# EAGLE design u10-normal (EAGLE 6.5.0)
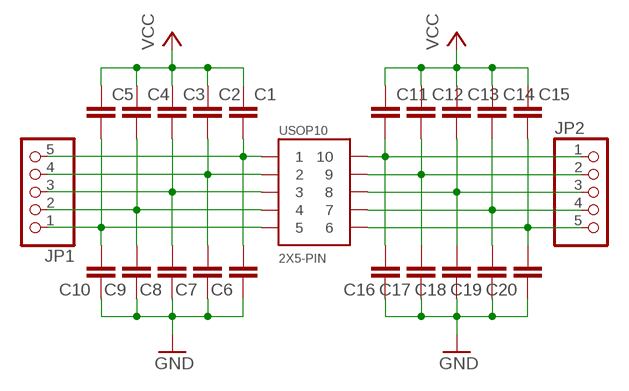
[diagram p0: schematic, sheet 1]

## Parts
C1  C-EUC0603  [C0603]
C2  C-EUC0603  [C0603]
C3  C-EUC0603  [C0603]
C4  C-EUC0603  [C0603]
C5  C-EUC0603  [C0603]
C6  C-EUC0805  [C0805]
C7  C-EUC0805  [C0805]
C8  C-EUC0805  [C0805]
C9  C-EUC0805  [C0805]
C10  C-EUC0805  [C0805]
C11  C-EUC0603  [C0603]
C12  C-EUC0603  [C0603]
C13  C-EUC0603  [C0603]
C14  C-EUC0603  [C0603]
C15  C-EUC0603  [C0603]
C16  C-EUC0805  [C0805]
C17  C-EUC0805  [C0805]
C18  C-EUC0805  [C0805]
C19  C-EUC0805  [C0805]
C20  C-EUC0805  [C0805]
JP1  PINHD-1X5  [1X05]
JP2  PINHD-1X5  [1X05]
USOP10  2X5-PIN  [USOP10]

## Nets
1: C1.2 C6.2 JP1.5 USOP10.P$1
2: C2.2 C7.2 JP1.4 USOP10.P$2
3: C3.2 C8.2 JP1.3 USOP10.P$3
4: C4.2 C9.2 JP1.2 USOP10.P$4
5: C5.2 C10.2 JP1.1 USOP10.P$5
GND: C6.1 C7.1 C8.1 C9.1 C10.1 C16.1 C17.1 C18.1 C19.1 C20.1
N$6: C15.2 C20.2 JP2.5 USOP10.P$6
N$7: C14.2 C19.2 JP2.4 USOP10.P$7
N$8: C13.2 C18.2 JP2.3 USOP10.P$8
N$9: C12.2 C17.2 JP2.2 USOP10.P$9
N$10: C11.2 C16.2 JP2.1 USOP10.P$10
VCC: C1.1 C2.1 C3.1 C4.1 C5.1 C11.1 C12.1 C13.1 C14.1 C15.1

## Library data of the parts
C1-C20 = p.peter-rcl:C-EU: CAPACITOR, European symbol
JP1 JP2 = pinhead:PINHD-1X5: PIN HEADER
USOP10 = p.peter-pacakages:2X5-PIN

## Board
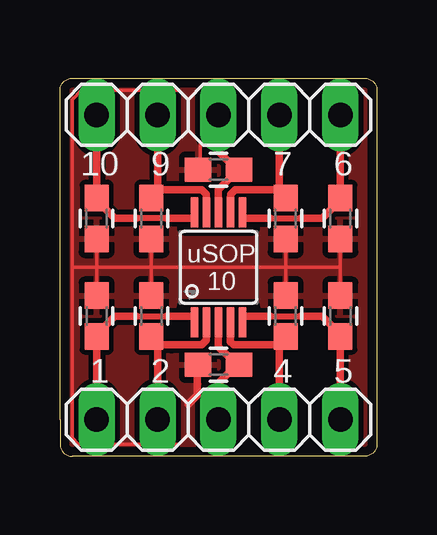
[diagram p1: board, top side]
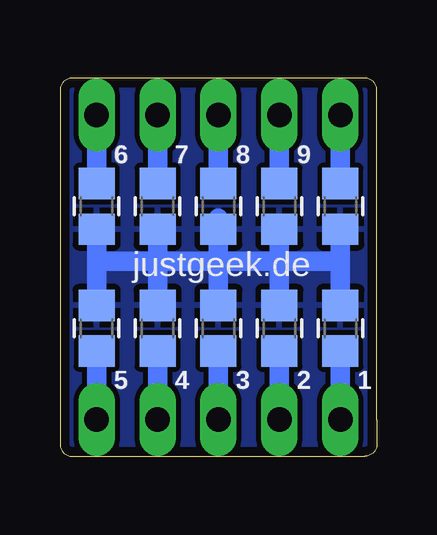
[diagram p2: board, bottom side, seen from below]

Size 13.21 x 15.75 mm. Coordinates in mm from the lower left corner, seen from the top.
Outline: 0,1.52 0,15.24 arc-90 0.51,15.75 11.68,15.75 12.7,15.75 arc-90 13.21,15.24 13.21,1.52 13.21,0.51 arc-90 12.7,0 0.51,0 arc-90 0,0.51 0,1.52
Copper layers (1*16): Top 0.0356mm / dielectric 1.5011mm / Bottom 0.0356mm
Design rules "oshpark": minimum track width 6mil, minimum drill 13mil, track to track 6mil, track to pad 6mil, pad to pad 6mil, via to via 6mil, smd to smd 6mil, copper to edge 15mil, drill to drill 6mil, minimum pad ring 7mil, minimum via ring 7mil, stop-mask expansion 4mil, vias tented up to drill 4.1mm, thermal gap 10mil
tRestrict: 6 lines

### Footprints (pad centres in the part's own frame; a part is rotated, then mirrored left to right if it is on the bottom)
C0603 = smd 1.1 x 1: 1 -0.85,0; 2 0.85,0
C0805 = smd 1.3 x 1.5: 1 -0.95,0; 2 0.95,0
1X05 = drill 1.016 long: 1 -5.08,0; 2 -2.54,0; 3 0,0; 4 2.54,0; 5 5.08,0
USOP10 = smd 0.3 x 1.25: P$1 -1,-2.3; P$2 -0.5,-2.3; P$3 0,-2.3; P$4 0.5,-2.3; P$5 1,-2.3; P$6 1,2.3; P$7 0.5,2.3; P$8 0,2.3; P$9 -0.5,2.3; P$10 -1,2.3

### Placement (x,y rotation side)
C1  1.52,5.84 270 top
C2  3.81,5.84 270 top
C3  6.6,3.81 0 top
C4  9.4,5.84 270 top
C5  11.68,5.84 270 top
C6  1.52,5.33 270 bottom
C7  4.06,5.33 270 bottom
C8  6.6,5.33 270 bottom
C9  9.14,5.33 270 bottom
C10  11.68,5.33 270 bottom
C11  1.52,9.91 90 top
C12  3.81,9.91 90 top
C13  6.6,11.94 0 top
C14  9.4,9.91 90 top
C15  11.68,9.91 90 top
C16  1.52,10.41 90 bottom
C17  4.06,10.41 90 bottom
C18  6.6,10.41 90 bottom
C19  9.14,10.41 90 bottom
C20  11.68,10.41 90 bottom
JP1  6.6,1.52 180 top
JP2  6.6,14.22 0 top
USOP10  6.6,7.87 0 top

### Tracks (layer width: path | path; a pad name or v marks a point on that pad's centre or on a via)
1
  Top 0.254: 3.18,5.84 4.45,5.84
  Top 0.305: C1.2 1.52,5.08 | 2.16,5.72 2.29,5.84 | 2.29,5.84 3.18,5.84 | 4.45,5.84 5.33,5.84 5.59,5.84 5.59,5.59 USOP10.P$1 | C1.2 JP1.5 | 2.16,5.72 2.29,5.84 | 2.29,5.84 2.16,5.72 | 2.16,5.72 1.91,5.46 1.65,5.21 1.65,5.12 C1.2 | 1.5,5.02 C1.2
  Bottom 0.813: C6.2 JP1.5
2
  Top 0.305: C2.2 3.81,4.83 | 3.81,4.83 3.81,5.08 | C2.2 3.81,4.83 | JP1.4 4.06,4.57 | USOP10.P$2 6.1,4.83 5.91,4.64 4.64,4.64 4.13,4.64 4.06,4.57 | C2.2 3.81,4.83 | 3.81,4.83 4.06,4.57
  Bottom 0.813: C7.2 JP1.4
3
  Top 0.305: USOP10.P$3 6.6,4.57 7.11,4.06 7.2,4.06 C3.2 7.37,3.81 6.6,3.05 JP1.3
  Bottom 0.813: C8.2 JP1.3
4
  Top 0.305: USOP10.P$4 7.1,5.15 7.1,4.77 7.24,4.64 9.14,4.64 9.08,4.64 9.14,4.57 | 9.14,4.57 9.4,4.83 C4.2 | JP1.2 9.14,4.57
  Bottom 0.813: C9.2 JP1.2
5
  Top 0.254: 8.76,5.84 10.03,5.84
  Top 0.305: USOP10.P$5 7.6,5.83 7.62,5.84 8.13,5.84 8.76,5.84 | 10.03,5.84 10.92,5.84 | 10.92,5.84 11.05,5.72 | 11.05,5.72 11.18,5.59 | 11.18,5.59 11.05,5.72 | JP1.1 C5.2 | 11.05,5.72 10.92,5.84 | 10.92,5.84 11.05,5.72 | 11.05,5.72 11.18,5.59 | 11.18,5.59 11.3,5.46 11.56,5.21 11.56,5.12 C5.2 | 11.64,5.14 C5.2
  Bottom 0.813: C10.2 JP1.1
GND
  Bottom 0.813: C6.1 1.52,8.13 | 1.52,8.13 2.03,8.13 | 2.03,8.13 4.06,8.13 | 4.06,8.13 6.6,8.13 | 6.6,8.13 9.14,8.13 | 9.14,8.13 11.18,8.13 11.68,8.13 | 11.68,8.13 C10.1 | C7.1 4.06,8.13 | C8.1 6.6,8.13 | C9.1 9.14,8.13 | 11.68,8.13 C20.1 | 9.14,8.13 C19.1 | 6.6,8.13 6.6,9.91 C18.1 | 4.06,8.13 C17.1 | 2.03,8.13 1.52,8.13 | 1.52,8.13 C16.1
  pour Bottom (isolate 0.203): -1.02,-1.02 -1.02,16.76 14.22,16.76 14.22,-1.02
N$6
  Top 0.254: 8.76,9.91 10.03,9.91
  Top 0.305: C15.2 JP2.5 | 8.76,9.91 7.87,9.91 7.62,9.91 7.62,10.16 USOP10.P$6 | 10.03,9.91 10.41,9.91 10.92,9.91 11.3,10.29 11.56,10.54 11.56,10.63 C15.2 | 11.56,10.8 C15.2
  Bottom 0.813: C20.2 JP2.5
N$7
  Top 0.305: JP2.4 9.14,11.43 9.14,11.11 | USOP10.P$7 7.1,10.79 7.11,10.8 7.11,10.92 7.3,11.11 9.14,11.11 | 9.14,11.11 9.14,11.05 9.27,10.92 9.4,10.8 C14.2
  Bottom 0.813: C19.2 JP2.4
N$8
  Top 0.305: USOP10.P$8 6.6,11.11 7.24,11.75 7.24,11.94 | 7.24,11.94 7.24,12.07 6.6,12.7 JP2.3 | C13.2 7.24,11.94
  Bottom 0.813: C18.2 JP2.3
N$9
  Top 0.305: JP2.2 4.06,11.3 4.06,11.18 | USOP10.P$9 6.1,10.91 5.91,11.11 4.13,11.11 4.06,11.18 | C12.2 3.81,10.38 3.81,10.92 4.06,11.18
  Bottom 0.813: C17.2 JP2.2
N$10
  Top 0.254: 4.45,9.91 3.18,9.91
  Top 0.305: JP2.1 C11.2 | USOP10.P$10 5.6,9.92 5.59,9.91 5.08,9.91 4.45,9.91 | 3.18,9.91 2.29,9.91 1.91,10.29 1.65,10.54 1.65,10.63 C11.2 | 1.56,10.8 C11.2
  Bottom 0.813: C16.2 JP2.1
VCC
  Top 0.152: 5.33,2.16 5.33,0.89 4.95,0.51 0.76,0.51 0.51,0.76 0.51,7.11 0.51,7.87 | 0.51,7.87 1.52,7.87 | 1.52,7.87 3.81,7.87 | 3.81,7.87 9.4,7.87 | 9.4,7.87 11.68,7.87 | 11.68,7.87 C15.1 | 11.68,7.87 C5.1 | C14.1 9.4,7.87 | C4.1 9.4,7.87 | C12.1 3.81,7.87 | C2.1 3.81,7.87 | C11.1 1.52,7.87 | C1.1 1.52,7.87 | C13.1 5.84,11.94 5.84,13.08 5.33,13.59 5.33,14.86 4.95,15.24 0.89,15.24 0.51,14.86 0.51,8.38 0.51,7.87
  Top 0.305: 1.61,7.11 C1.1 1.49,7.11 | 11.6,7.11 C5.1 | C4.1 9.4,7.11 | C3.1 5.84,3.81 5.72,3.81 5.72,2.54 5.33,2.16 | C2.1 3.81,7.11 C2.1
  pour Top (isolate 0.203): -1.02,-1.02 -1.02,16.76 14.22,16.76 14.22,-1.02

### Text on the board
tPlace: 10 | 9 | 7 | 6 | uSOP / 10 | 1 | 2 | 4 | 5
bPlace: 9 | 8 | 7 | 6 | justgeek.de | 1 | 2 | 3 | 4 | 5